# Altium project QS Quadcopter Control Board.PrjPcb
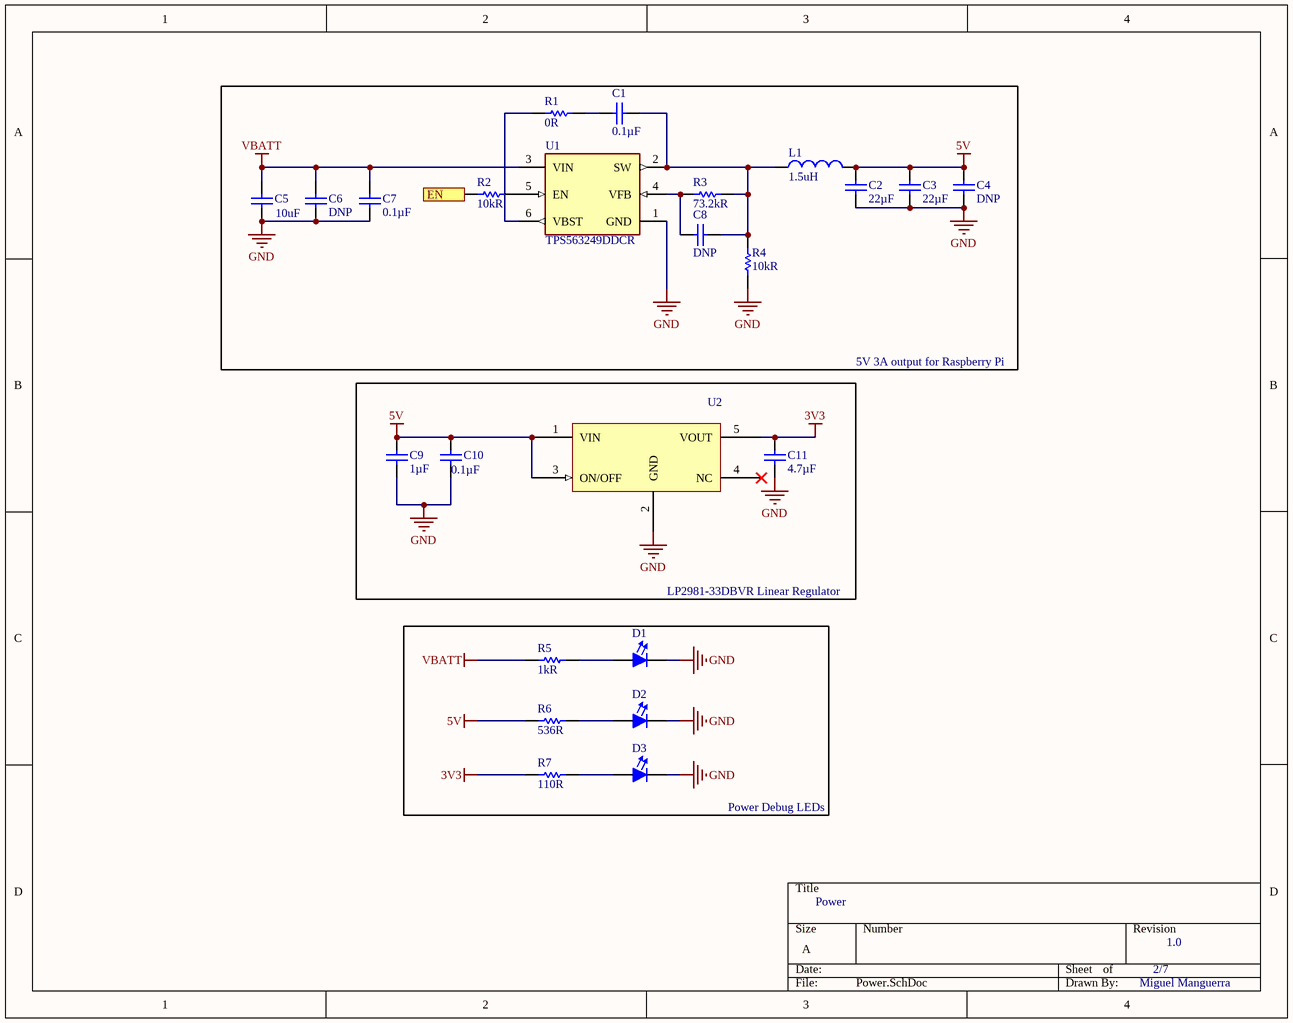
[diagram p0: Power.SchDoc]
4 sheets, 82 parts. Net scope: flat (ports and power ports of the same name join across sheets).
Board file: TBD name.PcbDoc
Sheets:
  Power.SchDoc
  Micro.SchDoc
  Communication.SchDoc
  Sensors.SchDoc

## Sheet Power.SchDoc
size A

### Parts
(Parts that share a designator on the sheet are numbered #1, #2 ... from top to bottom, then left to right.)
C1#1  Capacitance: 0.1µF  [CAPC1608N(0603")]  (hidden comment: 0.1uF, 50V, 10%, X7R, 0603)
C2#1  value 22µF  [CAPC2012N(0805")]  (hidden comment: 22uF 35V 0805 SMD, Ceramic)
C3  value 22µF  [CAPC2012N(0805")]  (hidden comment: 22uF 35V 0805 SMD, Ceramic)
C4  value DNP  [CAPC1608N(0603")]  (hidden comment: Placeholder_Capacitor_0603)
C5  Capacitance: 10uF  [CAPC2013X12N]  (hidden comment: 10uF, 25V, X5R, 0805)
C6  value DNP  [CAPC3216N(1206")]  (hidden comment: Placeholder_Capacitor_1206)
C7  Capacitance: 0.1µF  [CAPC1608N(0603")]  (hidden comment: 0.1uF, 50V, 10%, X7R, 0603)
C8  value DNP  [CAPC1608N(0603")]  (hidden comment: Placeholder_Capacitor_0603)
C9  value 1µF  [CAPC1608N(0603")]  (hidden comment: 1uF 25V 0603 SMD, Ceramic)
C10  value 0.1µF  [CAPC1608N(0603")]  (hidden comment: 0.1uF 16V 0603 SMD, Ceramic)
C11  value 4.7µF  [CAPC1608N(0603")]  (hidden comment: 4.7uF 10V 0603 SMD, Ceramic)
D1  LT Q39G-Q1OO-25-1  [FP-LB_Q39E-MFG]  (value not drawn)
D2  LT Q39G-Q1OO-25-1  [FP-LB_Q39E-MFG]  (value not drawn)
D3  LT Q39G-Q1OO-25-1  [FP-LB_Q39E-MFG]  (value not drawn)
L1  Inductance: 1.5uH  [INDC2520X12N]  (hidden comment: DFE252012P-1R5M=P2)
R1#1  value 0R  [RESC1608N(0603")]  (hidden comment: 0R, 1%, 1/10W, 0603 SMD)
R2  Resistance: 10kR  [RESC1608X55X25ML10T15]  (hidden comment: RC0603FR-0710KL)
R3  Resistance: 73.2kR  [RESC1608X55X30LL15T15]  (hidden comment: ERJ-3EKF7322V)
R4  Resistance: 10kR  [RESC1608X55X25ML10T15]  (hidden comment: RC0603FR-0710KL)
R5  Resistance: 1kR  [RESC1608X55X30ML15T15]  (hidden comment: ERJ3EKF1001V)
R6  536R  [RESC1608X55X30ML15T15]
R7  110R  [RESC1608X55X25ML10T15]
U1#1  TPS563249DDCR  [FP-DDC0005A-IPC_B]
U2  LP2981-33DBVR  [SOT95P280X145-5N]  (value not drawn)

### Blocks framed on the sheet
5V 3A output for Raspberry Pi: C1#1 C2#1 C3-C8 L1 R1#1 R2-R4 U1#1

### Ports
EN (in)

### Nets
3V3: C11.2(Cathode) R7.1 U2.5(VOUT)
5V: C2#1.2(Cathode) C3.2(Cathode) C4.2(Cathode) C9.2(Cathode) C10.2(Cathode) L1.2 R6.1 U2.1(VIN) U2.3(ON/OFF)
GND: C2#1.1(Anode) C3.1(Anode) C4.1(Anode) C5.2 C6.1(Anode) C7.1(Anode) C9.1(Anode) C10.1(Anode) C11.1(Anode) D1.1(Cathode) D2.1(Cathode) D3.1(Cathode) R4.1 U1#1.1(GND) U2.2(GND)
VBATT: C5.1 C6.2(Cathode) C7.2(Cathode) R5.1 U1#1.3(VIN)
NetC1#1_1: C1#1.1(Anode) C8.1(Anode) L1.1 R3.2 R4.2 U1#1.2(SW)
NetC1#1_2: C1#1.2(Cathode) R1#1.2
NetC8_2: C8.2(Cathode) R3.1 U1#1.4(VFB)
NetD1_2: D1.2(Anode) R5.2
NetD2_2: D2.2(Anode) R6.2
NetD3_2: D3.2(Anode) R7.2
NetR1#1_1: R1#1.1 U1#1.6(VBST)
NetR2_1: R2.1 U1#1.5(EN)
NetR2_2: R2.2 ; port EN

Not connected (* = marked no-connect by the designer): U2 4(NC)*

### Notes on the sheet
- LP2981-33DBVR Linear Regulator
- Power Debug LEDs
- Power
- 2/7
- 1.0
- Miguel Manguerra

### Library data of the parts
C1#1 C7 = CMP-006-0007-1: 0.1µF ±10% Ceramic Capacitor X7R 0603 (1608 Metric); Operating Temperature: -55°C ~ 125°C; Pin Count: 2; Design Item ID: 0.1uF, 50V, 10%, X7R, 0603; Package / Case: 0603 (1608 Metric); Source: AUVic_Schematic_Library_Capacitors.SchLib; ComponentLink1URL: https://www.digikey.ca/product-detail/en/tdk-corporation/C1608X7R1H104M080AA/445-5098-1-ND/2093713; ComponentLink1Description: Digi-Key; Mounting Type: Surface Mount, MLCC; Component Type: Standard; Created By: Poorna Chander Kalidas
C2#1 C3 = CMP-006-0036-1: Capacitor, Ceramic, 35V, +/- 20%, 0805 SMD, X5R; Design Item ID: 22uF 35V 0805 SMD, Ceramic; Source: AUVic_Schematic_Library_Capacitors.SchLib; Pin Count: 2; Component Type: Standard; Publisher: AUVic; PackageDescription: Chip Capacitor; Published: 14-06-01
C4 C8 = CMP-006-0054-1: Placeholder 0603 SMT Footprint; Made By: Ashwin Sira; Date Created: 2016-06-26; Design Item ID: Placeholder_Capacitor_0603; PackageDescription: Chip Capacitor; Component Type: Standard (No BOM); Pin Count: 2; Source: AUVic_Schematic_Library_Capacitors.SchLib; Publisher: AUVic
C5 = CMP-00114-1: 0805 10 uF 25 V ±10% Tolerance X5R SMT Multilayer Ceramic Capacitor; Dielectric: X7R; Max Operating Temperature: 85°C; Resistor Type: Ceramic; Lead Free: Lead Free; Tolerance: 10%; Height: 1.25mm; Package Quantity: 1; Voltage Rating: 25V; Width: 0.049inch; Min Operating Temperature: -55°C; Case Code (Imperial): 0805; Number of Pins: 2; Thickness: 0.053inch; Length: 0.079inch; Case Code (Metric): 2012; Mount: Surface Mount; Case/Package: 0805; Packaging: Tape and Reel; REACH SVHC: No SVHC; Termination: SMD/SMT; Voltage Rating (DC): 25V
C6 = CMP-006-0056-1: Placeholder 1206 SMT Footprint; Made By: Ashwin Sira; PackageDescription: Chip Capacitor; Component Type: Standard (No BOM); Source: AUVic_Schematic_Library_Capacitors.SchLib; Date Created: 2016-06-26; Design Item ID: Placeholder_Capacitor_1206; Pin Count: 2; Publisher: AUVic
C9 = CMP-006-0027-1: Capacitor, Ceramic, 25V, +/- 10%, 0603 SMD, X5R; MFG: Murata-Electronics-North-America; MFG#: GRM188R61E105KA12D; Created By: Andy Bates; Publisher: AUVic; Source: AUVic_Schematic_Library_Capacitors.SchLib; Component Type: Standard; Pin Count: 2; PackageDescription: Chip Capacitor; Design Item ID: 1uF 25V 0603 SMD, Ceramic; Published: 16-06-27
C10 = CMP-006-0005-1: Capacitor, Ceramic, 16V, +/- 10%, 0603 SMD, X7R; Created By: Andy Bates; Published: 16-04-26; PackageDescription: Chip Capacitor; Pin Count: 2; Source: AUVic_Schematic_Library_Capacitors.SchLib; Design Item ID: 0.1uF 16V 0603 SMD, Ceramic; Component Type: Standard; Publisher: AUVic
C11 = CMP-006-0043-1: Capacitor, Ceramic, 10V, +/- 10%, 0603 SMD, X5R; MFG: Samsung; MFG#: GRM188R61A475KE15D; PackageDescription: Chip Capacitor; Source: AUVic_Schematic_Library_Capacitors.SchLib; Published: 16-06-23; Created By: Ashwin Sira; Component Type: Standard; Pin Count: 2; Publisher: AUVic; Design Item ID: 4.7uF 10V 0603 SMD, Ceramic
D1-D3 = CMP-00064-3: LED GREEN DIFFUSED 0603 SMD; Dominant Wavelength: 530nm; Luminous Intensity: 280mcd; Lens Style: Diffused,Colorless,Rectangular; Number of LEDs: 1; Forward Voltage: 2.85V; Test Current: 5mA; Reverse Voltage: 5V; Forward Current: 15mA; Luminous Flux: 0.55lm; Radiation Hardening: No; Packaging: Tape and Reel; Mount: Surface Mount; Color: Green; Max Operating Temperature: 85°C; Number of Elements: 1; Number of Pins: 2; Min Operating Temperature: -40°C; Depth: 0.9mm; Case/Package: SMD/SMT; Length: 1.7mm
L1 = CMP-00112-1: Ind Metal Alloy Shielded 1.5uH 20% 1MHz Powdered Iron 2.6A 1008 T/R; Core Material: Ferrite; Current Rating: 3.5A; DC Resistance (DCR): 60mR; Packaging: Tape and Reel; Mount: Surface Mount; Depth: 2mm; Tolerance: 20%; Shielding: Shielded; Test Frequency: 1MHz; Width: 0.079inch; Case Code (Metric): 2520; Min Operating Temperature: -40°C; Resistor Type: Wirewound,Metal Alloy; Length: 0.098inch; Case/Package: 1008; Case Code (Imperial): 1008; Height - Seated (Max): 0.039inch; Max Operating Temperature: 125°C; Max DC Current: 2.6A
R1#1 = CMP-047-0001-1: Made By: Ashwin Sira; Owned By: AUVic; Component Type: Standard; Design Item ID: 0R, 1%, 1/10W, 0603 SMD; Last Edited: 14-05-31; Created On: 14-05-31; Source: AUVic_Schematic_Library_Resistors.SchLib; Pin Count: 2
R2 R4 = CMP-00037-1: Res General Purpose Thick Film 0603 10K Ohm 1% 1/10W ±100ppm/°C Molded SMD Paper T/R; Power Rating: 100mW; Voltage Rating (DC): 50V; Voltage Rating: 75V; Case/Package: 0603; Weight: 7.1E-05oz; Case Code (Imperial): 0603; Composition: Thick Film; Depth: 0.8mm; Min Operating Temperature: -55°C; Width: 0.8mm; Height: 0.45mm; Military Standard: Not; Packaging: Tape and Reel; Termination: SMD/SMT; Lead Free: Lead Free; Temperature Coefficient: 100ppm/°C; Number of Pins: 2; Max Operating Temperature: 155°C; Lead Pitch: 0.3mm; REACH SVHC: No SVHC; Case Code (Metric): 1608; Tolerance: 1%; Length: 1.6mm
R3 = CMP-00029-1: Res Thick Film 0603 73.2K Ohm 1% 0.1W(1/10W) ±100ppm/C Pad SMD Automotive T/R; Max Power Dissipation: 100mW; Voltage Rating (DC): 50V; Temperature Coefficient: 100ppm/°C; Voltage Rating: 75V; Packaging: Tape and Reel; REACH SVHC: No SVHC; Case Code (Imperial): 0603; Mount: Surface Mount; Height: 0.022inch; Military Standard: Not; Features: Automotive AEC-Q200; Power Rating: 100mW; Width: 0.031inch; Termination: SMD/SMT; Number of Terminations: 2; Composition: Thick Film; Length: 1.6mm; Depth: 0.8mm; Min Operating Temperature: -55°C; Package Quantity: 1; Max Operating Temperature: 155°C; Case/Package: 0603; Case Code (Metric): 1608; Tolerance: 1%; Radiation Hardening: No; Contact Plating: Tin; Lead Free: Lead Free
R5 = CMP-00062-2: Res Thick Film 0603 1K Ohm 1% 1/10W ±100ppm/°C Molded SMD Punched Carrier T/R; Voltage Rating (DC): 75V; Max Power Dissipation: 100mW; Package Quantity: 5000; Composition: Thick Film; Min Operating Temperature: -55°C; Case Code (Metric): 1608; Case/Package: 0603; Lead Free: Lead Free; Packaging: Tape and Reel; Case Code (Imperial): 0603; Width: 0.8mm; Military Standard: Not; Contact Plating: Tin; Length: 1.6mm; Max Operating Temperature: 155°C; Height: 0.45mm; Temperature Coefficient: 100ppm/°C; Depth: 0.8mm; Voltage Rating: 75V; Tolerance: 1%; Features: Automotive AEC-Q200; Mount: Surface Mount; REACH SVHC: No SVHC; Power Rating: 100mW; Radiation Hardening: No; Number of Terminations: 2; Number of Pins: 2; Termination: SMD/SMT
R6 = CMP-00071-2: SMD Chip Resistor, 0603 [1608 Metric], 536 ohm, ERJ3EK Series, 75 V, Thick Film, 100 mW; Tolerance: 1%; Voltage Rating (DC): 50V; Voltage Rating: 75V; Power Rating: 100mW; Temperature Coefficient: 100ppm/°C; Max Operating Temperature: 155°C; Package Quantity: 1; REACH SVHC: No SVHC; Depth: 0.8mm; Composition: Thick Film; Height: 0.022inch; Packaging: Tape and Reel; Contact Plating: Tin; Lead Free: Lead Free; Length: 1.6mm; Case/Package: 0603; Military Standard: Not; Features: Automotive AEC-Q200; Resistance: 536R; Termination: SMD/SMT; Max Power Dissipation: 100mW; Width: 0.8mm; Mount: Surface Mount; Case Code (Metric): 1608; Case Code (Imperial): 0603; Number of Terminations: 2; Min Operating Temperature: -55°C
R7 = CMP-00069-2: RES SMD 110 OHM 1% 1/10W 0603; Max Power Dissipation: 100mW; Voltage Rating (DC): 50V; Temperature Coefficient: 100ppm/°C; Working Voltage: 75V; Military Standard: Not; Termination: SMD/SMT; Number of Terminations: 2; Features: Moisture Resistant; Min Operating Temperature: -55°C; Power Rating: 100mW; Height: 0.022inch; Package Quantity: 1; Lead Free: Lead Free; Tolerance: 1%; Voltage Rating: 50V; Resistance: 110R; Composition: Thick Film; Case Code (Imperial): 0603; Length: 1.6mm; Packaging: Tape and Reel; Case Code (Metric): 1608; Max Operating Temperature: 155°C; Depth: 0.8mm; Case/Package: 0603; Width: 0.031inch
U1#1 = CMP-044-0004-1: 17-V, 3-A, constant 1.4-MHz synchronous step-down voltage regulator 6-SOT-23-THIN -40 to 125
U2 = CMP-044-0003-2: IC REG LINEAR 3.3V 100MA SOT23-5; Max Input Voltage: 16V; Min Input Voltage: 2.2V; Number of Regulators: 1; Output Voltage Accuracy: 2%; Polarity: Positive; Input Bias Current: 600uA; Output Type: Fixed; Dropout Voltage: 200mV; Package Quantity: 1; REACH SVHC: No SVHC; Output Voltage: 3.3V; Min Operating Temperature: -40°C; Case/Package: SOT-23; Max Output Current: 100mA; Lead Free: Lead Free; Max Operating Temperature: 125°C; Number of Outputs: 1; Number of Pins: 5; Mount: Surface Mount; Accuracy: 2%; Nominal Output Voltage: 3.3V; Output Current: 100mA; Packaging: Tape and Reel; Quiescent Current: 600uA; Radiation Hardening: No; Contact Plating: Tin,Matte

## Sheet Micro.SchDoc
size A
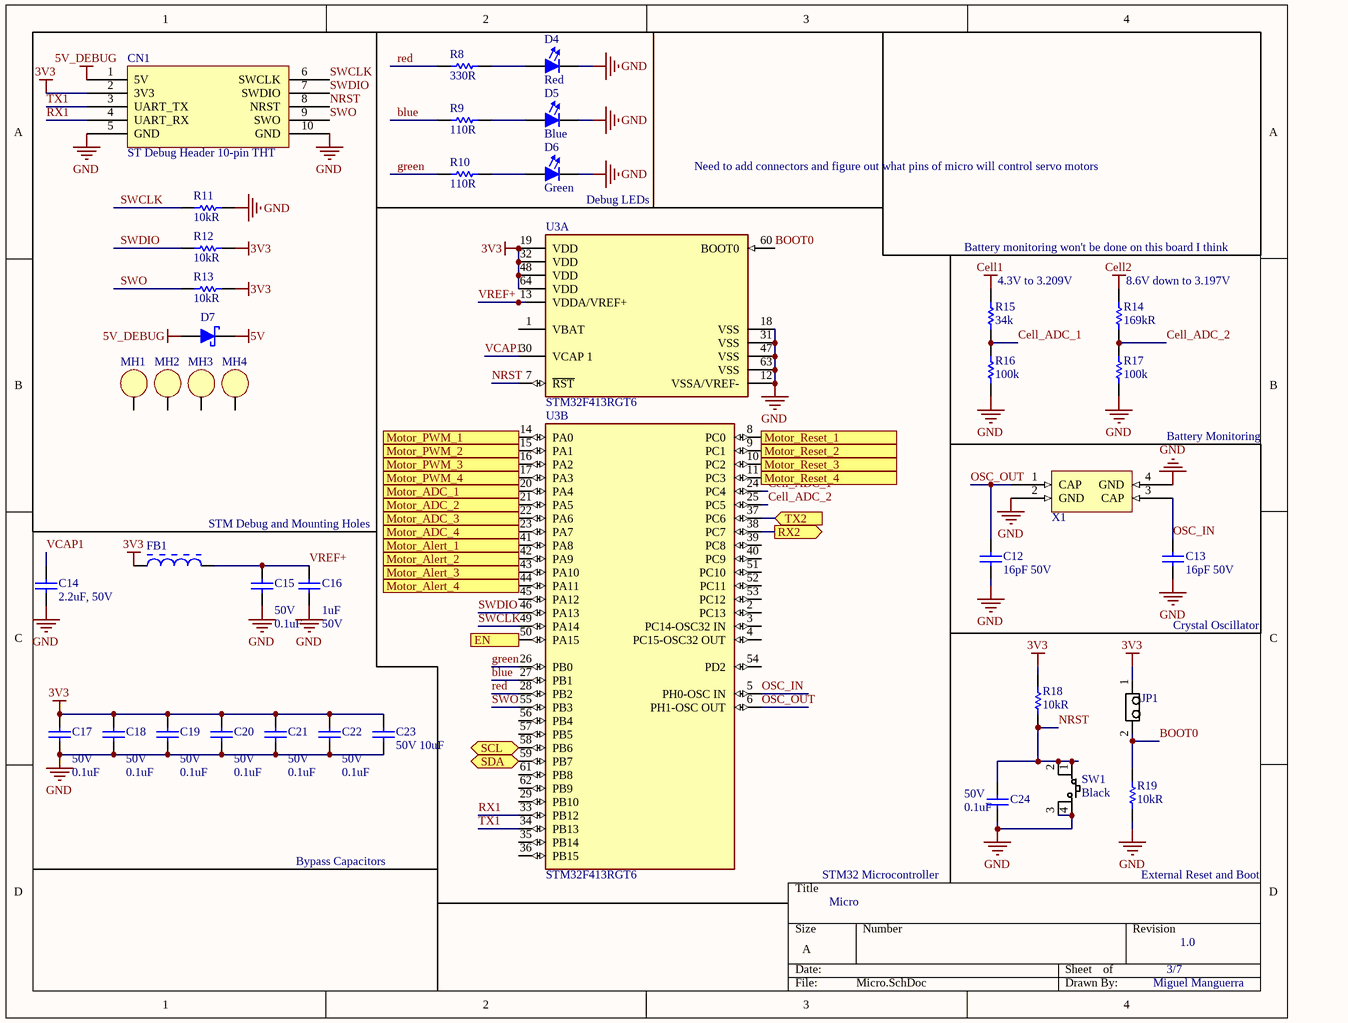
[diagram p1: Micro.SchDoc]

### Parts
C12  Voltage: 16pF 50V  [CAPC1608X90X35ML10T15]  (hidden comment: 16pF Ceramic 50V 5% 0603)
C13  Voltage: 16pF 50V  [CAPC1608X90X35ML10T15]  (hidden comment: 16pF Ceramic 50V 5% 0603)
C14  2.2uF, 50V  [CAPC1608N(0603")]
C15  Voltage: 50V  Capacitance: 0.1uF  [FP-CL10-0_1-MFG]  (hidden comment: CL10B104JB8NNNC)
C16  Capacitance: 1uF  Voltage: 50V  [0803 CAP]  (hidden comment: CL21B105KBFNNNG)
C17  Voltage: 50V  Capacitance: 0.1uF  [FP-CL10-0_1-MFG]  (hidden comment: CL10B104JB8NNNC)
C18  Voltage: 50V  Capacitance: 0.1uF  [FP-CL10-0_1-MFG]  (hidden comment: CL10B104JB8NNNC)
C19  Voltage: 50V  Capacitance: 0.1uF  [FP-CL10-0_1-MFG]  (hidden comment: CL10B104JB8NNNC)
C20  Voltage: 50V  Capacitance: 0.1uF  [FP-CL10-0_1-MFG]  (hidden comment: CL10B104JB8NNNC)
C21  Voltage: 50V  Capacitance: 0.1uF  [FP-CL10-0_1-MFG]  (hidden comment: CL10B104JB8NNNC)
C22  Voltage: 50V  Capacitance: 0.1uF  [FP-CL10-0_1-MFG]  (hidden comment: CL10B104JB8NNNC)
C23  50V 10uF  [CAPC3216X180X50LL20T30]
C24  Voltage: 50V  Capacitance: 0.1uF  [FP-CL10-0_1-MFG]  (hidden comment: CL10B104JB8NNNC)
CN1  ST Debug Header 10-pin THT  [10-pin shrouded header THT]
D4  Red  [FP-LB_Q39E-MFG]
D5  Blue  [FP-LB_Q39E-MFG]
D6  Green  [FP-LB_Q39E-MFG]
D7  CUS08F30,H3F  [SC-76]  (value not drawn)
FB1  BLM18AG601SN1D  [MURA-BLM18-F-H1-CHIP-2_V]  (value not drawn)
JP1  1x2 Male Header  [2X1 Males Header]  (value not drawn)
MH1  Mount_Hole_3mm  [Mount-Hole_3mm]  (value not drawn)
MH2  Mount_Hole_3mm  [Mount-Hole_3mm]  (value not drawn)
MH3  Mount_Hole_3mm  [Mount-Hole_3mm]  (value not drawn)
MH4  Mount_Hole_3mm  [Mount-Hole_3mm]  (value not drawn)
R8  Resistance: 330R  [FP-CRCW0603-e3-IPC_C]  (hidden comment: CRCW0603330RFKEA)
R9  Resistance: 110R  [RESC1608X55X25ML10T15]  (hidden comment: RC0603FR-07110RL)
R10  Resistance: 110R  [RESC1608X55X25ML10T15]  (hidden comment: RC0603FR-07110RL)
R11  10kR  [RESC1608N(0603")]
R12  10kR  [RESC1608N(0603")]
R13  10kR  [RESC1608N(0603")]
R14  Resistance: 169kR  [RESC0603(1608)_M]  (hidden comment: 169kR, 1%, 1/10W, 0603)
R15  Resistance: 34k  [RESC1608N(0603")]  (hidden comment: 34kR, 1%, 1/10W, 0603)
R16  value 100k  [RESC1608N(0603")]  (hidden comment: 100kR, 1%, 1/10W, 0603 SMD)
R17  value 100k  [RESC1608N(0603")]  (hidden comment: 100kR, 1%, 1/10W, 0603 SMD)
R18  10kR  [RESC1608N(0603")]
R19  10kR  [RESC1608N(0603")]
SW1  Button Colour: Black  [4-SPST-NO]  (hidden comment: PTS645SL43SMTR92LFS)
U3  STM32F413RGT6  [FP-LQFP64-5W-MFG]  (parts A,B of 2)
X1  CRYSTAL 8.0MHZ 16PF SMD  [QFN250P750X520X140_HS-5M]  (value not drawn)

### Blocks framed on the sheet
STM Debug and Mounting Holes: CN1 D7 MH1-MH4 R11-R13
Debug LEDs: D4-D6 R8-R10

### Ports
EN (out), Motor_ADC_1 (in), Motor_ADC_2 (in), Motor_ADC_3 (in), Motor_ADC_4 (in), Motor_Alert_1 (in), Motor_Alert_2 (in), Motor_Alert_3 (in), Motor_Alert_4 (in), Motor_PWM_1 (out), Motor_PWM_2 (out), Motor_PWM_3 (out), Motor_PWM_4 (out), Motor_Reset_1, Motor_Reset_2, Motor_Reset_3, Motor_Reset_4, RX2 (out), SCL (bidir), SDA (bidir), TX2 (in)

### Nets
3V3: C17.1 C18.1 C19.1 C20.1 C21.1 C22.1 C23.1 CN1.2(3V3) FB1.1 JP1.1 R12.1 R13.1 R18.1 U3.19(VDD) U3.32(VDD) U3.48(VDD) U3.64(VDD)
5V: D7.K(Cathode)
5V_DEBUG: CN1.1(5V) D7.A(Anode)
Cell1: R15.2
Cell2: R14.2
GND: C12.1 C13.1 C14.2(Cathode) C15.2 C16.2 C17.2 C18.2 C19.2 C20.2 C21.2 C22.2 C23.2 C24.2 CN1.5(GND) CN1.10(GND) D4.1(Cathode) D5.1(Cathode) D6.1(Cathode) R11.1 R16.1 R17.1 R19.2 SW1.3 SW1.4 U3.12(VSSA/VREF-) U3.18(VSS) U3.31(VSS) U3.47(VSS) U3.63(VSS) X1.2(GND) X1.4(GND)
blue: R9.1 U3.27(PB1)
BOOT0: JP1.2 R19.1 U3.60(BOOT0)
Cell_ADC_1: R15.1 R16.2 U3.24(PC4)
Cell_ADC_2: R14.1 R17.2 U3.25(PC5)
green: R10.1 U3.26(PB0)
NRST: C24.1 CN1.8(NRST) R18.2 SW1.1 SW1.2 U3.7(~{RST})
OSC_IN: C13.2 U3.5(PH0-OSC_IN) X1.3(CAP)
OSC_OUT: C12.2 U3.6(PH1-OSC_OUT) X1.1(CAP)
red: R8.1 U3.28(PB2)
RX1: CN1.4(UART_RX) U3.33(PB12)
SWCLK: CN1.6(SWCLK) R11.2 U3.49(PA14)
SWDIO: CN1.7(SWDIO) R12.2 U3.46(PA13)
SWO: CN1.9(SWO) R13.2 U3.55(PB3)
TX1: CN1.3(UART_TX) U3.34(PB13)
VCAP1: C14.1(Anode) U3.30(VCAP_1)
VREF+: C15.1 C16.1 FB1.2 U3.13(VDDA/VREF+)
NetD4_2: D4.2(Anode) R8.2
NetD5_2: D5.2(Anode) R9.2
NetD6_2: D6.2(Anode) R10.2
NetR2_2: U3.50(PA15) ; port EN
NetR22_1: U3.59(PB7) ; port SDA
NetR23_1: U3.58(PB6) ; port SCL
NetU3_8: U3.8(PC0) ; port Motor_Reset_1
NetU3_9: U3.9(PC1) ; port Motor_Reset_2
NetU3_10: U3.10(PC2) ; port Motor_Reset_3
NetU3_11: U3.11(PC3) ; port Motor_Reset_4
NetU3_14: U3.14(PA0) ; port Motor_PWM_1
NetU3_15: U3.15(PA1) ; port Motor_PWM_2
NetU3_16: U3.16(PA2) ; port Motor_PWM_3
NetU3_17: U3.17(PA3) ; port Motor_PWM_4
NetU3_20: U3.20(PA4) ; port Motor_ADC_1
NetU3_21: U3.21(PA5) ; port Motor_ADC_2
NetU3_22: U3.22(PA6) ; port Motor_ADC_3
NetU3_23: U3.23(PA7) ; port Motor_ADC_4
NetU3_37: U3.37(PC6) ; port TX2
NetU3_38: U3.38(PC7) ; port RX2
NetU3_41: U3.41(PA8) ; port Motor_Alert_1
NetU3_42: U3.42(PA9) ; port Motor_Alert_2
NetU3_43: U3.43(PA10) ; port Motor_Alert_3
NetU3_44: U3.44(PA11) ; port Motor_Alert_4

Not connected (* = marked no-connect by the designer): MH1 1; MH2 1; MH3 1; MH4 1; U3 1(VBAT) 2(PC13) 3(PC14-OSC32_IN) 4(PC15-OSC32_OUT) 29(PB10) 35(PB14) 36(PB15) 39(PC8) 40(PC9) 45(PA12) 51(PC10) 52(PC11) 53(PC12) 54(PD2) 56(PB4) 57(PB5) 61(PB8) 62(PB9)

### Notes on the sheet
- Need to add connectors and figure out what pins of micro will control servo motors
- Battery monitoring won't be done on this board I think
- (near R15) 4.3V to 3.209V
- (near R14) 8.6V down to 3.197V
- Battery Monitoring
- Crystal Oscillator
- Bypass Capacitors
- STM32 Microcontroller
- Micro
- External Reset and Boot
- 3/7
- 1.0
- Miguel Manguerra

### Library data of the parts
C12 C13 = CMP-00087-2: Cap Ceramic 16pF 50V C0G 5% SMD 0603 125C Paper T/R; Temperature Coefficient: 30ppm/°C; Termination: SMD/SMT; Voltage Rating: 50V; Dielectric: C0G; Radiation Hardening: No; Voltage Rating (DC): 50V; Max Operating Temperature: 125°C; Height: 0.8mm; Width: 0.8mm; Length: 1.6mm; Package Quantity: 1; Lead Free: Lead Free; Min Operating Temperature: -55°C; Case Code (Metric): 1608; Case/Package: 0603; Tolerance: 5%; Mount: Surface Mount; Capacitance: 16pF; Thickness: 0.035inch; Case Code (Imperial): 0603; Depth: 0.8mm; Packaging: Tape and Reel
C14 = CMP-006-0030-1: Capacitor, Ceramic, 50V, 10%, 0603 SMD, X5R; Value: 2.2µF; Date Created: *; Design Item ID: 2.2uF, 50V, 0603 SMD, X5R, Ceramic; Made By: *; Publisher: AUVic; Source: AUVic_Schematic_Library_Capacitors.SchLib; Pin Count: 2; PackageDescription: Chip Capacitor; Component Type: Standard
C15 C17-C22 C24 = CMP-00000-3: CAP CER 0.1UF 50V X7R 0603; Tolerance: 5%; Material: Ceramic; Case Code (Imperial): 0603; Mount: Surface Mount; Thickness: 0.035inch; Depth: 0.8mm; Packaging: Tape and Reel; Package Quantity: 1; Dielectric: X7R; Height: 0.8mm; Radiation Hardening: No; Max Operating Temperature: 125°C; Voltage Rating: 50V; Case/Package: 0603; Min Operating Temperature: -55°C; Case Code (Metric): 1608; Length: 1.6mm; Contact Plating: Tin; Width: 0.031inch
C16 = CMP-00005-1: SAMSUNG ELECTRO-MECHANICS - CL21B105KBFNNNG - MLCC CAPACITORS; Tolerance: 10%; Material: Ceramic; Dielectric: X7R; Case/Package: 0805; Voltage Rating: 50V; Contact Plating: Tin; Max Operating Temperature: 125°C; Termination: Wraparound; Package Quantity: 3000; Depth: 1.25mm; Mount: Surface Mount; Min Operating Temperature: -55°C; Thickness: 0.053inch; Packaging: Tape and Reel; Case Code (Metric): 2012; Length: 2mm; Case Code (Imperial): 0805; Width: 0.049inch
C23 = CMP-00004-1: Cap Ceramic 10uF 50V X7R 10% Pad SMD 1206 125°C T/R; Thickness: 0.071inch; Case/Package: 1206; Case Code (Metric): 3216; Case Code (Imperial): 1206; Voltage Rating: 50V; Length: 0.126inch; Max Operating Temperature: 125°C; Voltage Rating (DC): 50V; Capacitance: 10uF; Dielectric: X7R; Lead Free: Lead Free; Min Operating Temperature: -55°C; Tolerance: 10%; Mount: Surface Mount; Packaging: Tape and Reel; Width: 0.063inch
CN1 = CMP-00011-6: CONN HEADER VERT 10POS 2.54MM; Row Spacing: 0.1inch; Connector Type: Male Pin; Number of Positions: 10; Packaging: Tray; Package Quantity: 1; Color: Black; Number of Rows: 2; Termination: Solder; Contact Plating: Gold; Lead Free: Lead Free; Pitch: 0.1inch; Mount: Through Hole
D4 = CMP-00066-2: LED Red 645nm 2-Pin Chip 0603(1608Metric) T/R; Lens Transparency: Diffused; Power Dissipation: 65mW; Forward Voltage: 2.5V; Dominant Wavelength: 633nm; Number of Elements: 1; Lens Style: Diffused,Flat,Colorless,Rectangular; Lens Color: White; Viewing Angle: 160°; Luminous Flux: 0.33lm; Test Current: 20mA; Forward Current: 25mA; Luminous Intensity: 180mcd; Reverse Voltage: 12V; Lens Size: 0.8mm; Max Operating Temperature: 85°C; Depth: 0.9mm; Illumination Color: Red; Color: Red; Packaging: Tape and Reel; Min Operating Temperature: -30°C; Case Code (Imperial): 0603; Case Code (Metric): 1608; Number of Pins: 2; Mount: Surface Mount; Height: 0.8mm; Package Quantity: 1; Length: 1.7mm; Width: 0.8mm; Number of LEDs: 1; Case/Package: 0603; Radiation Hardening: No
D5 = CMP-00063-3: LED BLUE DIFFUSED 0603 SMD; Luminous Flux: 0.13lm; Lens Size: 0.8mm; Lens Color: White; Viewing Angle: 130°; Luminous Intensity: 42mcd; Number of LEDs: 1; Dominant Wavelength: 470nm; Lens Style: Flat,Diffused,Colorless,Rectangular; Test Current: 5mA; Forward Voltage: 2.85V; Packaging: Tape and Reel; Case/Package: 0603; Height: 0.4mm; Number of Pins: 2; Mount: Surface Mount; Case Code (Metric): 1608; Case Code (Imperial): 0603; Lens Transparency: Diffused; Width: 0.8mm; Length: 1.6mm; Color: Blue; Radiation Hardening: No
D6 = CMP-00064-3: as D1 on sheet Power; Radiation Hardening: No; Packaging: Tape and Reel; Mount: Surface Mount; Color: Green; Max Operating Temperature: 85°C; Number of Elements: 1; Number of Pins: 2; Min Operating Temperature: -40°C; Depth: 0.9mm; Case/Package: SMD/SMT; Length: 1.7mm
D7 = CMP-057-0000-2: Diode Schottky 30V 800mA Surface Mount USC; Peak Non-Repetitive Surge Current: 5A; Element Configuration: Single; Peak Reverse Current: 50uA; Packaging: Tape and Reel; Mount: Surface Mount; Average Rectified Current: 800mA; Case/Package: SOD; Max Reverse Voltage (DC): 30V; Min Operating Temperature: -55°C; Contact Plating: Tin,Silver; Max Repetitive Reverse Voltage (Vrrm): 30V; Number of Pins: 2; Max Operating Temperature: 125°C
FB1 = CMP-00016-1: MURATA - BLM18AG601SN1D - Feritový Korálek, 0603 / 1608, 600 ohm, 500 mA, Série BLM18A, 0.38 ohm, ± 25%; DC Current: 500mA; Impedance: 600R; DC Resistance (DCR): 380mR; Core Material: Ferrite; Shielding: Unshielded; Number of Lines: 1; Test Frequency: 100MHz; Material: Steel,Ferrite; Height: 0.8mm; Depth: 0.8mm; Min Operating Temperature: -55°C; Packaging: Tape and Reel; Weight: 7.1E-05oz; Width: 0.8mm; Military Standard: Not; Max Operating Temperature: 125°C; Max Current Rating: 500mA; Case Code (Metric): 1608; Length: 1.6mm; Case Code (Imperial): 0603; Package Quantity: 1; Max DC Current: 500mA; REACH SVHC: No SVHC; Termination: SMD/SMT; Current Rating: 500mA; Lead Free: Lead Free; Tolerance: 25%; Case/Package: 0603; Number of Pins: 2; Radiation Hardening: No; Frequency: 100MHz; Number of Circuits: 1
JP1 = CMP-004-0001-1: Made By: Andy Bates; Source: AUVic_Schematic_Library_Connectors.SchLib; Pin Count: 2; Design Item ID: 1x2 Male Header; Component Type: Standard
MH1-MH4 = CMP-004-0010-4: Mounting hold for M3 hex standoff; Source: AUVic_Schematic_Library_Connectors.SchLib; Design Item ID: Mount_Hole_3mm; Component Type: Standard; Pin Count: 1
R8 = CMP-00067-2: Res Thick Film 0603 330 Ohm 1% 0.1W(1/10W) +/-100ppm/ßC Pad SMD Automotive T/R; Voltage Rating (DC): 75V; Power Rating: 100mW; Temperature Coefficient: 100ppm/°C; Contact Plating: Tin; Package Quantity: 10; Tolerance: 1%; Packaging: Tape and Reel; Case/Package: 0603; Max Operating Temperature: 155°C; Case Code (Metric): 1608; Case Code (Imperial): 0603; Min Operating Temperature: -55°C; Length: 1.55mm; Height: 0.45mm; Lead Free: Lead Free; Termination: SMD/SMT; Voltage Rating: 75V; Composition: Thick Film; Weight: 7.1E-05oz; Military Standard: Not; Max Power Dissipation: 100mW; REACH SVHC: Unknown; Mount: Surface Mount; Depth: 0.85mm; Features: Automotive AEC-Q200; Number of Terminations: 2; Radiation Hardening: No; Width: 0.033inch
R9 R10 = CMP-00069-1: RES SMD 110 OHM 1% 1/10W 0603; Max Power Dissipation: 100mW; Voltage Rating (DC): 50V; Temperature Coefficient: 100ppm/°C; Working Voltage: 75V; Military Standard: Not; Termination: SMD/SMT; Number of Terminations: 2; Features: Moisture Resistant; Min Operating Temperature: -55°C; Power Rating: 100mW; Height: 0.022inch; Package Quantity: 1; Lead Free: Lead Free; Tolerance: 1%; Voltage Rating: 50V; Composition: Thick Film; Case Code (Imperial): 0603; Length: 1.6mm; Packaging: Tape and Reel; Case Code (Metric): 1608; Max Operating Temperature: 155°C; Depth: 0.8mm; Case/Package: 0603; Width: 0.031inch
R11-R13 R18 R19 = CMP-047-0013-1: 10kR, 1%, 1/10W, 0603 SMD; Owned By: AUVic; Made By: Ashwin Sira; Value: 10k; Design Item ID: 10kR; Pin Count: 2; Component Type: Standard; Created On: 14-05-31; Last Edited: 14-05-31; Source: AUVic_Schematic_Library_Resistors.SchLib
R14 = CMP-00096-2: RES 169K OHM 1% 1/10W 0603; Power Rating: 100mW; Temperature Coefficient: 100ppm/°C; Width: 0.031inch; Length: 0.061inch; Number of Terminations: 2; Radiation Hardening: No; Case Code (Metric): 1608; Height: 0.022inch; Tolerance: 1%; Case/Package: 0603; Features: Automotive AEC-Q200; Contact Plating: Tin,Matte; Packaging: Tape and Reel; Max Power Dissipation: 100mW; Max Operating Temperature: 155°C; Mount: Surface Mount; Case Code (Imperial): 0603; Lead Free: Lead Free; Resistor Type: Thick Film; Min Operating Temperature: -55°C
R15 = CMP-047-0046-1: RES 34K OHM 1/10W 1% 0603 SMD; Manufacturer Part Number: RC0603FR-0734KL; Manufacturer: Yageo; Temperature Coefficient: ±100ppm/°C; Power (Watts): 0.1W, 1/10W; ComponentLink1Description: http://www.yageo.com/documents/recent/PYu-RC0603_51_RoHS_L_4.pdf; Features: Moisture Resistant; Operating Temperature: -55°C ~ 155°C; Size / Dimension: 0.063" L x 0.031" W (1.60mm x 0.80mm); Category: Resistors; Package / Case: 0603 (1608 Metric); Height: 0.022" (0.55mm); Composition: Thick Film; Packaging: Cut Tape (CT); Component Type: Standard; Supplier Device Package: 0603; Pricing 1: 1=0.1, 10=0.015, 25=0.0108, 100=0.006, 250=0.00456, 500=0.00364, 1000=0.00268, 2500=0.00233 (USD); Pin Count: 2; Design Item ID: 34kR, 1%, 1/10W, 0603; Source: AUVic_Schematic_Library_Resistors.SchLib; RoHS: RoHS Compliant; Stock 1: 192; Number of Terminations: 2; ComponentLink1URL: http://www.yageo.com/documents/recent/PYu-RC0603_51_RoHS_L_4.pdf; Tolerance: ±1%
R16 R17 = CMP-047-0010-1: Made By: Andy Bates; Owned By: AUVic; Component Type: Standard; Pin Count: 2; Design Item ID: 100kR, 1%, 1/10W, 0603 SMD; Source: AUVic_Schematic_Library_Resistors.SchLib; Last Edited: 14-06-30; Created On: 14-06-30
SW1 = CMP-00077-1: Black Switch Tactile N.O. SPST Round Button Gull Wing 0.05A 12VDC 100000Cycles 1.27N SMD T/R; Actuator Material: Nylon,Polyamide; Switch Function: Off-Mom; Actuator Type: Standard; Illumination Type: Non-Illuminated; Max Voltage Rating (DC): 12V; Current Rating: 50mA; Actuator Length: 0.85mm; Contact Resistance: 100mR; Depth: 9mm; Length: 6mm; Termination: Gull Wing; Max Operating Temperature: 60°C; Mechanical Life: 100000Cycles; Packaging: Tape and Reel; Color: Black; Throw Configuration: SPST; Min Operating Temperature: -20°C; Mount: Surface Mount; Lead Free: Lead Free; Operating Force: 1.27N; Contact Material: Bronze,Brass,Silver; Max Current Rating: 50mA; Package Quantity: 1000; Voltage Rating (DC): 12V; Contact Plating: Silver; Orientation: Straight
U3 = CMP-00006-1: STMICROELECTRONICS - STM32F413RGT6 - MCU, ARM CORTEX-M4, 100MHZ, LQFP-64; Number of I/Os: 50; Oscillator Type: Internal; Peripherals: Brown-out Detect/Reset,POR,PWM,WDT,DMA,LCD; Interface: I2C,SPI,USB,IrDA,MMC,SDIO,UART,USART; Memory Type: FLASH; Memory Size: 1MB; Case/Package: LQFP; Packaging: Tray; Core Architecture: ARM; Min Operating Temperature: -40°C; Max Operating Temperature: 85°C; Frequency: 100MHz
X1 = CMP-00079-2: 8MHz ±30ppm Crystal 16pF 80 Ohms 4-SMD, No Lead; ESR (Equivalent Series Resistance): 80R; Frequency Stability: 50ppm; Min Operating Temperature: -20°C; Load Capacitance: 16pF; Frequency: 8MHz; Length: 7.5mm; Number of Pins: 4; Case/Package: CSMD; Max Operating Temperature: 70°C; Depth: 5.2mm; Packaging: Tape and Reel

## Sheet Communication.SchDoc
size A
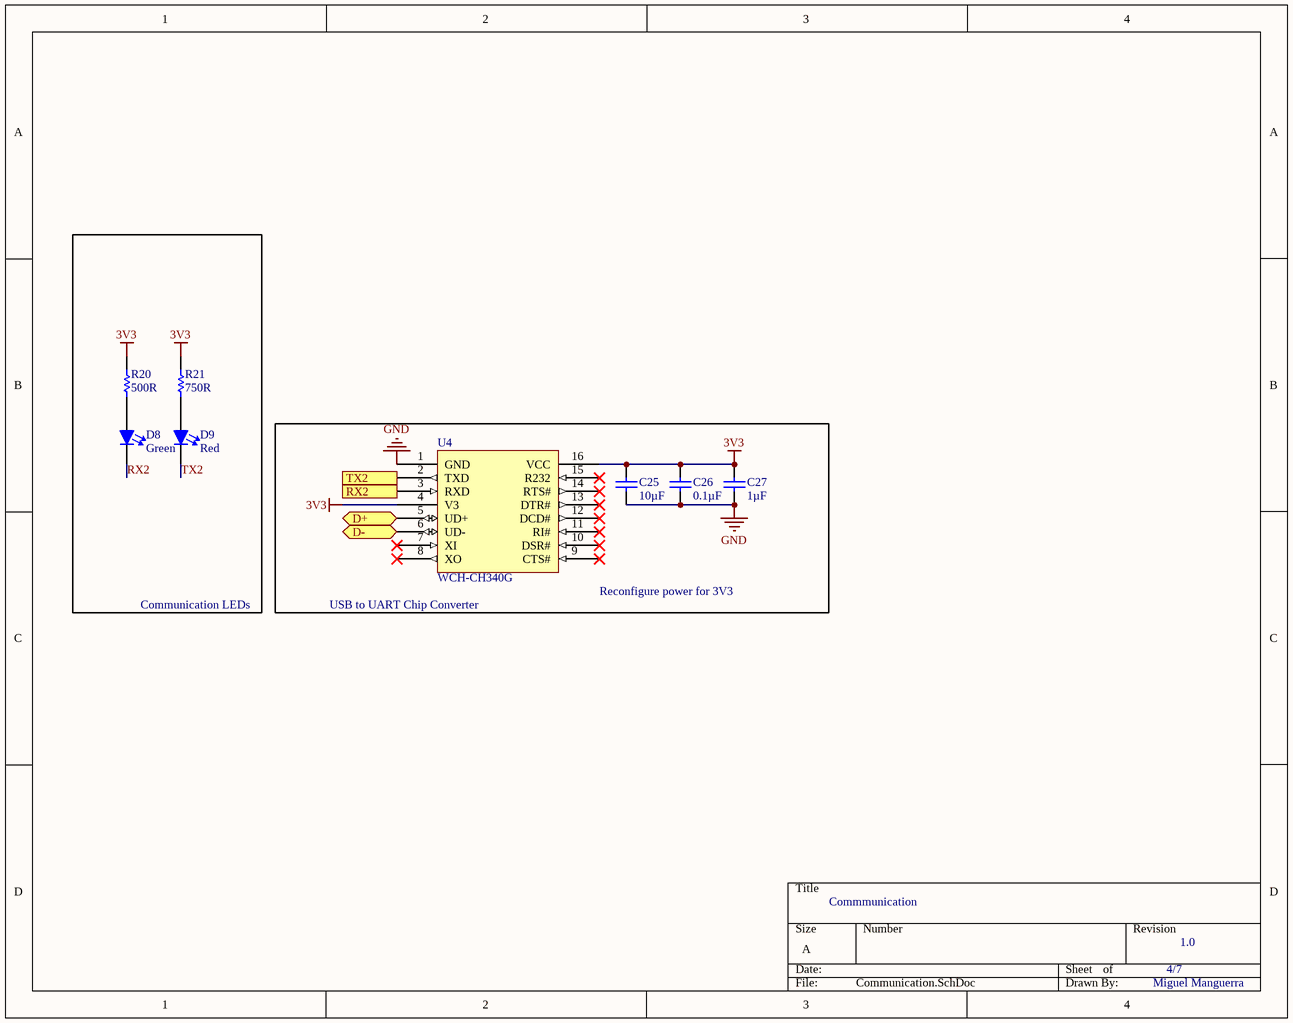
[diagram p2: Communication.SchDoc]

### Parts
C25  value 10µF  [CAPC1608N(0603")]  (hidden comment: 0.1uF 16V 0603 SMD, Ceramic)
C26  value 0.1µF  [CAPC1608N(0603")]  (hidden comment: 0.1uF 16V 0603 SMD, Ceramic)
C27  value 1µF  [CAPC1608N(0603")]  (hidden comment: 1uF 50V 0603 SMD, Ceramic)
D8  Color: Green  [FP-LB_Q39E-MFG]  (hidden comment: LT Q39G-Q1OO-25-1)
D9  Color: Red  [FP-LB_Q39E-MFG]  (hidden comment: LSQ976-NR-1)
R20  Resistance: 500R  [RESC0603(1608)_N]  (hidden comment: RC0603FR-07750RL)
R21  Resistance: 750R  [RESC0603(1608)_N]  (hidden comment: RC0603FR-07750RL)
U4  WCH-CH340G  [SOP127P600X175-16N]

### Blocks framed on the sheet
Communication LEDs: D8 D9 R20 R21

### Ports
D+ (bidir), D- (bidir), RX2 (in), TX2 (out)

### Nets
3V3: C25.2(Cathode) C26.2(Cathode) C27.2(Cathode) R20.1 R21.2 U4.4(V3) U4.16(VCC)
GND: C25.1(Anode) C26.1(Anode) C27.1(Anode) U4.1(GND)
RX2: D8.1(Cathode)
TX2: D9.1(Cathode)
NetD8_2: D8.2(Anode) R20.2
NetD9_2: D9.2(Anode) R21.1
NetU3_37: U4.2(TXD) ; port TX2
NetU3_38: U4.3(RXD) ; port RX2
NetU4_5: U4.5(UD+) ; port D+
NetU4_6: U4.6(UD-) ; port D-

Not connected (* = marked no-connect by the designer): U4 7(XI)* 8(XO)* 9(CTS#)* 10(DSR#)* 11(RI#)* 12(DCD#)* 13(DTR#)* 14(RTS#)* 15(R232)*

### Notes on the sheet
- (near U4) USB to UART Chip Converter
- (near U4) Reconfigure power for 3V3
- Commmunication
- 4/7
- 1.0
- Miguel Manguerra

### Library data of the parts
C25 C26 = CMP-006-0005-1: as C10 on sheet Power; Created By: Andy Bates; Published: 16-04-26; PackageDescription: Chip Capacitor; Pin Count: 2; Source: AUVic_Schematic_Library_Capacitors.SchLib; Design Item ID: 0.1uF 16V 0603 SMD, Ceramic; Component Type: Standard; Publisher: AUVic
C27 = CMP-006-0028-1: Capacitor, Ceramic, 50V, +/- 10%, 0603 SMD, X5R; Design Item ID: 1uF 50V 0603 SMD, Ceramic; Created By: Lyden Smith; PackageDescription: Chip Capacitor; Source: AUVic_Schematic_Library_Capacitors.SchLib; Date Created: 2017-10-26; Pin Count: 2; Component Type: Standard
D8 = CMP-00064-3: as D1 on sheet Power; Radiation Hardening: No; Packaging: Tape and Reel; Mount: Surface Mount; Max Operating Temperature: 85°C; Number of Elements: 1; Number of Pins: 2; Min Operating Temperature: -40°C; Depth: 0.9mm; Case/Package: SMD/SMT; Length: 1.7mm
D9 = CMP-00066-2: as D4 on sheet Micro; Max Operating Temperature: 85°C; Depth: 0.9mm; Illumination Color: Red; Packaging: Tape and Reel; Min Operating Temperature: -30°C; Case Code (Imperial): 0603; Case Code (Metric): 1608; Number of Pins: 2; Mount: Surface Mount; Height: 0.8mm; Package Quantity: 1; Length: 1.7mm; Width: 0.8mm; Number of LEDs: 1; Case/Package: 0603; Radiation Hardening: No
R20 R21 = CMP-00070-1: Res Thick Film 0603 750 Ohm 1% 0.1W(1/10W) ±100ppm/C Epoxy SMD T/R; Voltage Rating (DC): 50V; Power Rating: 100mW; Temperature Coefficient: 100ppm/°C; Height: 0.022inch; Tolerance: 1%; Voltage Rating: 50V; Case Code (Metric): 1608; Packaging: Tape and Reel; Depth: 0.8mm; Package Quantity: 1; Termination: SMD/SMT; Number of Terminations: 2; Min Operating Temperature: -55°C; Case/Package: 0603; Composition: Thick Film; Width: 0.031inch; Max Operating Temperature: 155°C; Max Power Dissipation: 100mW; Length: 1.6mm; Military Standard: Not; Features: Moisture Resistant; Case Code (Imperial): 0603; Lead Free: Lead Free
U4 = CMP-031-0001-1: USB to UART Transceiver. USB 2.0 2Mbps. LCSC #C14267; LCSC Part Number: C14267

## Sheet Sensors.SchDoc
size A
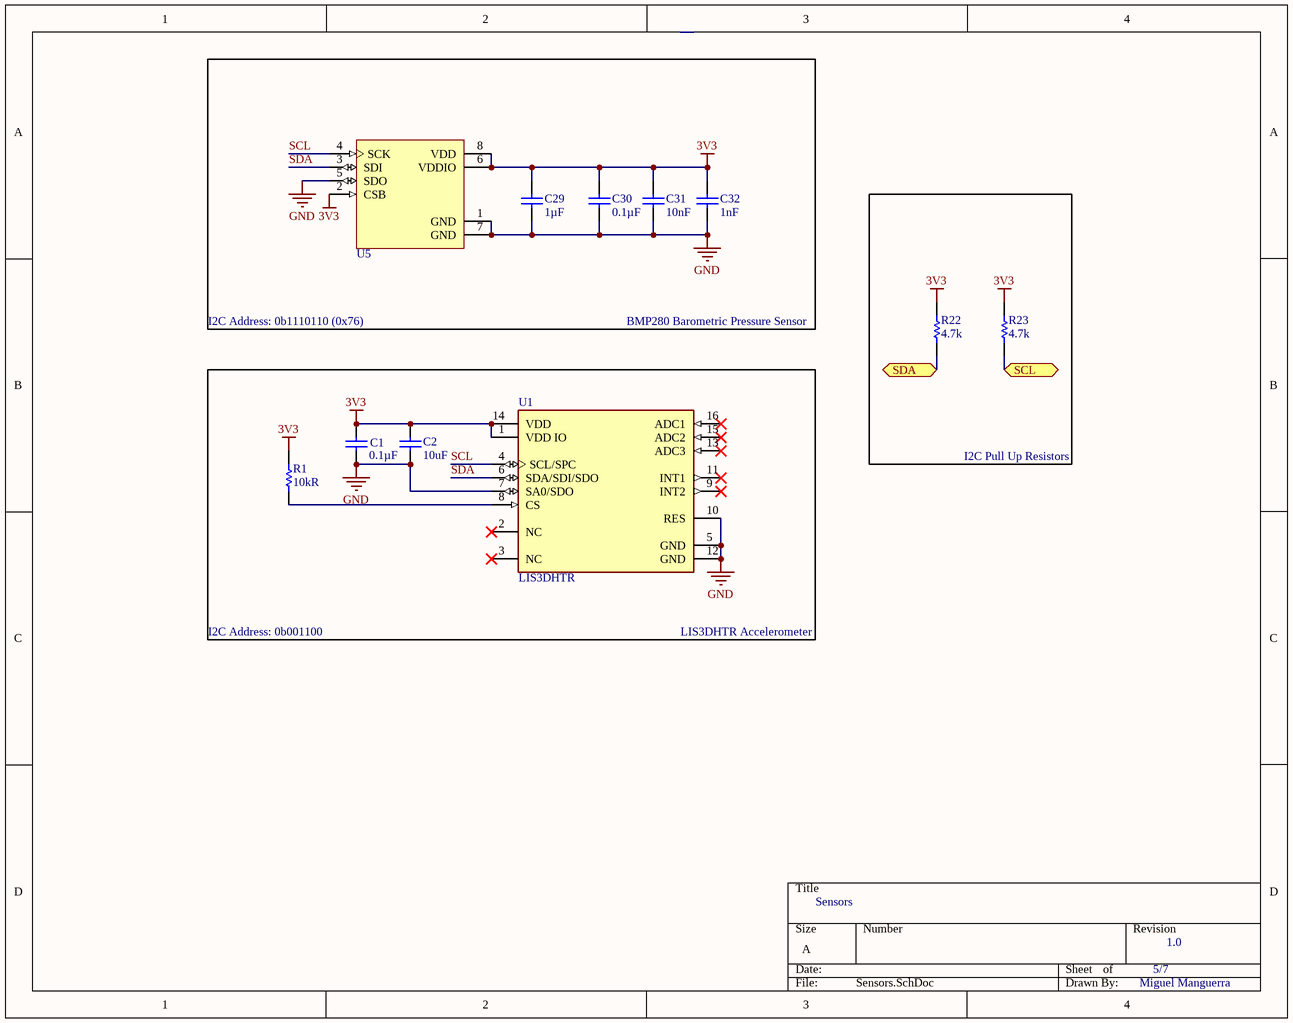
[diagram p3: Sensors.SchDoc]

### Parts
(Parts that share a designator on the sheet are numbered #1, #2 ... from top to bottom, then left to right.)
C1#2  Capacitance: 0.1µF  [CAPC1608N(0603")]  (hidden comment: 0.1uF, 50V, 10%, X7R, 0603)
C2#2  Capacitance: 10uF  [CAPC3216X180X50ML20T30]  (hidden comment: CL31B106KBHNNNE)
C29  value 1µF  [CAPC1608N(0603")]  (hidden comment: 1uF 25V 0603 SMD, Ceramic)
C30  Capacitance: 0.1µF  [CAPC1608N(0603")]  (hidden comment: 0.1uF, 50V, 10%, X7R, 0603)
C31  value 10nF  [CAPC1608N(0603")]  (hidden comment: 10 nF, 50V 0603 SMD, Ceramic)
C32  value 1nF  [CAPC1608N(0603")]  (hidden comment: 1nF, Ceramic, 50V, +-1%, SMD, NP0)
R1#2  Resistance: 10kR  [RESC1608X55X25ML10T15]  (hidden comment: RC0603FR-0710KL)
R22  value 4.7k  [RESC1608N(0603")]  (hidden comment: 4.7kR, 1%, 1/8W, 0603 SMD)
R23  value 4.7k  [RESC1608N(0603")]  (hidden comment: 4.7kR, 1%, 1/8W, 0603 SMD)
U1#2  LIS3DHTR  [FP-LGA-16-7983231-MFG]
U5  BMP280 Barometric Pressure Sensor  [BOSC-LGA-8_V]  (value not drawn)

### Blocks framed on the sheet
I2C Pull Up Resistors: R22 R23

### Ports
SCL (bidir), SDA (bidir)

### Nets
3V3: C1#2.1(Anode) C2#2.2 C29.2(Cathode) C30.2(Cathode) C31.2(Cathode) C32.2(Cathode) R1#2.2 R22.2 R23.2 U1#2.1(VDD_IO) U1#2.14(VDD) U5.2(CSB) U5.6(VDDIO) U5.8(VDD)
GND: C1#2.2(Cathode) C2#2.1 C29.1(Anode) C30.1(Anode) C31.1(Anode) C32.1(Anode) U1#2.5(GND) U1#2.7(SA0/SDO) U1#2.10(RES) U1#2.12(GND) U5.1(GND) U5.5(SDO) U5.7(GND)
SCL: U1#2.4(SCL/SPC) U5.4(SCK)
SDA: U1#2.6(SDA/SDI/SDO) U5.3(SDI)
NetR1#2_1: R1#2.1 U1#2.8(CS)
NetR22_1: R22.1 ; port SDA
NetR23_1: R23.1 ; port SCL

Not connected (* = marked no-connect by the designer): U1#2 2(NC)* 3(NC)* 9(INT2)* 11(INT1)* 13(ADC3)* 15(ADC2)* 16(ADC1)*

### Notes on the sheet
- I2C Address: 0b1110110 (0x76)
- BMP280 Barometric Pressure Sensor
- I2C Address: 0b001100
- LIS3DHTR Accelerometer
- Sensors
- 5/7
- 1.0
- Miguel Manguerra

### Library data of the parts
C1#2 C30 = CMP-006-0007-1: as C1#1 on sheet Power; Operating Temperature: -55°C ~ 125°C; Pin Count: 2; Design Item ID: 0.1uF, 50V, 10%, X7R, 0603; Package / Case: 0603 (1608 Metric); Source: AUVic_Schematic_Library_Capacitors.SchLib; ComponentLink1URL: https://www.digikey.ca/product-detail/en/tdk-corporation/C1608X7R1H104M080AA/445-5098-1-ND/2093713; ComponentLink1Description: Digi-Key; Mounting Type: Surface Mount, MLCC; Component Type: Standard; Created By: Poorna Chander Kalidas
C2#2 = CMP-00004-2: Cap Ceramic 10uF 50V X7R 10% Pad SMD 1206 125°C T/R; Voltage Rating: 50V; Case/Package: 1206; Max Operating Temperature: 125°C; Min Operating Temperature: -55°C; Voltage Rating (DC): 50V; Width: 0.063inch; Packaging: Tape and Reel; Lead Free: Lead Free; Mount: Surface Mount; Case Code (Imperial): 1206; Thickness: 0.071inch; Length: 0.126inch; Dielectric: X7R; Case Code (Metric): 3216; Tolerance: 10%
C29 = CMP-006-0027-1: as C9 on sheet Power; Created By: Andy Bates; Publisher: AUVic; Source: AUVic_Schematic_Library_Capacitors.SchLib; Component Type: Standard; Pin Count: 2; PackageDescription: Chip Capacitor; Design Item ID: 1uF 25V 0603 SMD, Ceramic; Published: 16-06-27
C31 = CMP-006-0010-1: Capacitor, Ceramic, 50V, +/- 10%, 0603 SMD; MFG: Samsung; MFG#: GRM188R61A475KE15D; Created By: Gabriel; Design Item ID: 10 nF, 50V 0603 SMD, Ceramic; PackageDescription: Chip Capacitor; Source: AUVic_Schematic_Library_Capacitors.SchLib; Published: 16-06-23; Pin Count: 2; Publisher: AUVic; Component Type: Standard
C32 = CMP-006-0026-1: Capacitor, Ceramic, 50V, +-1%, 0603 SMD, NP0; Made By: Jordan Day; Date Created: 09/28/2016; Component Type: Standard; Source: AUVic_Schematic_Library_Capacitors.SchLib; Pin Count: 2; Design Item ID: 1nF, Ceramic, 50V, +-1%, SMD, NP0; Publisher: AUVic; PackageDescription: Chip Capacitor
R1#2 = CMP-00037-2: Res General Purpose Thick Film 0603 10K Ohm 1% 1/10W ±100ppm/°C Molded SMD Paper T/R; Voltage Rating (DC): 50V; Power Rating: 100mW; Voltage Rating: 75V; REACH SVHC: No SVHC; Temperature Coefficient: 100ppm/°C; Military Standard: Not; Case Code (Metric): 1608; Case/Package: 0603; Number of Pins: 2; Lead Pitch: 0.3mm; Case Code (Imperial): 0603; Depth: 0.8mm; Lead Free: Lead Free; Composition: Thick Film; Termination: SMD/SMT; Height: 0.45mm; Packaging: Tape and Reel; Length: 1.6mm; Tolerance: 1%; Min Operating Temperature: -55°C; Width: 0.8mm; Max Operating Temperature: 155°C; Weight: 7.1E-05oz
R22 R23 = CMP-047-0049-1: Owned By: AUVic; Made By: Ashwin Sira; Design Item ID: 4.7kR, 1%, 1/8W, 0603 SMD; Pin Count: 2; Created On: 14-05-31; Component Type: Standard; Source: AUVic_Schematic_Library_Resistors.SchLib; Last Edited: 14-05-31
U1#2 = CMP-0234-00055-5: ACCEL 2-16G I2C/SPI 16LGA; Interface: I2C; Bandwidth: 5kHz; Operating Supply Voltage: 2.5V; Min Supply Voltage: 1.71V; Resolution: 16b; Max Supply Voltage (DC): 3.6V; Axis: X, Y, Z; Operating Supply Current: 11uA; Sensor Type: 3 Axis; Output Type: Digital; Lead Free: Lead Free; Case/Package: LGA; REACH SVHC: No SVHC; Width: 3mm; Height: 1mm; Packaging: Tape and Reel; Contact Plating: Gold; Length: 3mm; Package Quantity: 1; Min Supply Voltage (DC): 1.71V; Max Operating Temperature: 85°C; Min Operating Temperature: -40°C; Number of Pins: 16; Radiation Hardening: No; Depth: 3mm; Max Supply Voltage: 3.6V
U5 = CMP-00103-3: BMP280 Absolute Barometric Pressure Sensor for Battery Powered Devices 2 x 2.5mm; Operating Pressure: 15.95PSI; Port Style: No Port; Output Type: SPI,I2C; Max Pressure: 290.08PSI; Pressure Type: Absolute; Termination: SMD/SMT; Case/Package: SMD/SMT; Min Operating Temperature: -40°C; Number of Pins: 8; Lead Free: Lead Free; Max Operating Temperature: 85°C

## Nets that join several sheets
3V3: Power (C11.2 R7.1 U2.5), Micro (17 pins), Communication (7 pins), Sensors (14 pins)
5V: Power (9 pins), Micro (D7.K)
GND: Power (15 pins), Micro (31 pins), Communication (C25.1 C26.1 C27.1 U4.1), Sensors (13 pins)
NetR2_2: Power (R2.2), Micro (U3.50)
NetR22_1: Micro (U3.59), Sensors (R22.1)
NetR23_1: Micro (U3.58), Sensors (R23.1)
NetU3_37: Micro (U3.37), Communication (U4.2)
NetU3_38: Micro (U3.38), Communication (U4.3)